# EAGLE schematic NMOS_DESIGN (EAGLE 8.4.1)

## Sheet 1 of 2
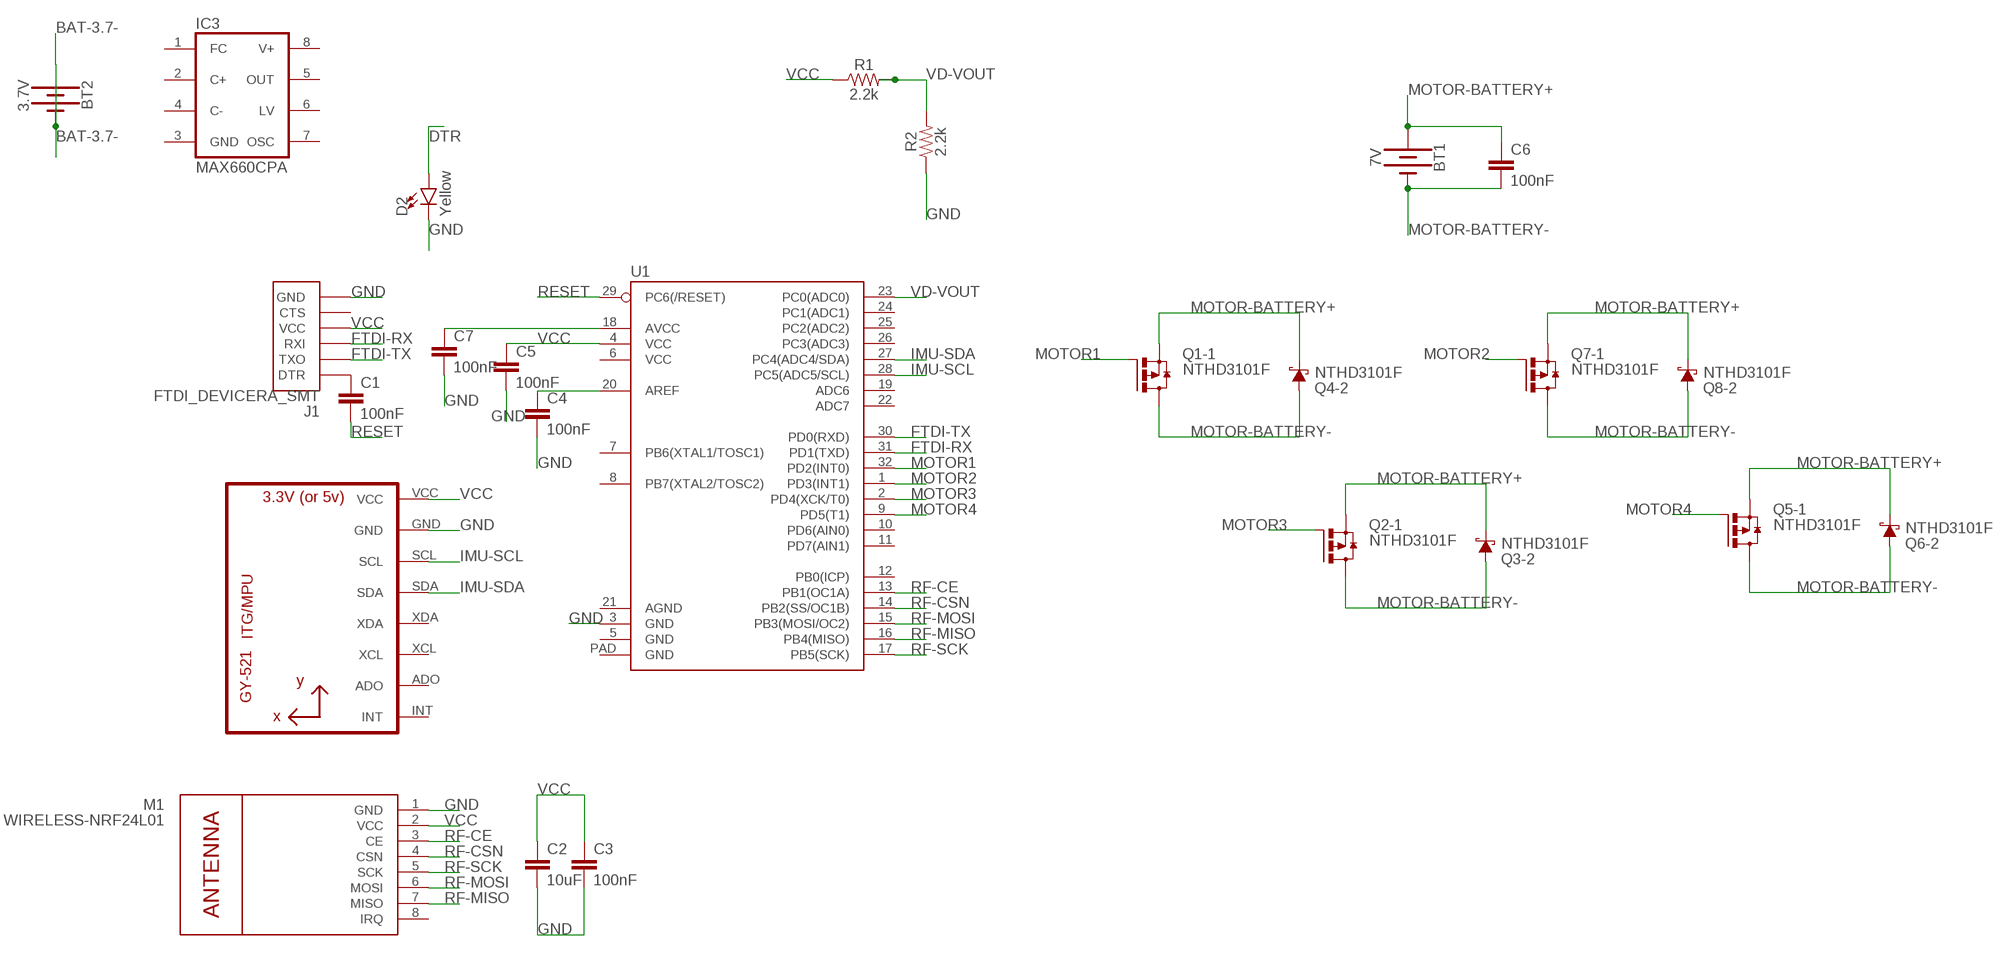
[diagram p0: schematic, sheet 1]

### Parts
BT1  7V  BATTERY-9V  [BATTCON_9V]
BT2  3.7V  BATTERY-9V  [BATTCON_9V]
C1  100nF  0.1UF-25V(+80/-20%)(0603)  [0603-CAP]
C2  10uF  CAP0603-CAP  [0603-CAP]
C3  100nF  CAP0603-CAP  [0603-CAP]
C4  100nF  CAP0603-CAP  [0603-CAP]
C5  100nF  CAP0603-CAP  [0603-CAP]
C6  100nF  CAP0603-CAP  [0603-CAP]
C7  100nF  CAP0603-CAP  [0603-CAP]
D2  Yellow  LED-YELLOW0603  [LED-0603]
IC3  MAX660CPA  [DIL08]
J1  FTDI_DEVICERA_SMT  [FTDI_DEVICE_RA_SMT]
M1  WIRELESS-NRF24L01  [WIRELESS-NRF24L01]
Q1  NTHD3101F  [CHIPFET-1206A]
Q2  NTHD3101F  [CHIPFET-1206A]
Q3  NTHD3101F  [CHIPFET-1206A]
Q4  NTHD3101F  [CHIPFET-1206A]
Q5  NTHD3101F  [CHIPFET-1206A]
Q6  NTHD3101F  [CHIPFET-1206A]
Q7  NTHD3101F  [CHIPFET-1206A]
Q8  NTHD3101F  [CHIPFET-1206A]
R1  2.2k  2.2KOHM-0603-1/10W-1%  [0603]
R2  2.2k  2.2KOHM-0603-1/10W-1%  [0603]
U1  ATMEGA328P_MLFMLF32  [MLF32-PAD]
U2  GY-521MPU6050  [GY-521]

### Nets
BAT-3.7-: BT2.+ BT2.-
DTR: D2.A
FTDI-RX: J1.3(RXI) U1.31(PD1(TXD))
FTDI-TX: J1.2(TXO) U1.30(PD0(RXD))
GND: C2.2 C3.2 C4.2 C5.2 C7.2 D2.C J1.6(GND) M1.1(GND) R2.1 U1.3(GND) U2.GND
IMU-SCL: U1.28(PC5(ADC5/SCL)) U2.SCL
IMU-SDA: U1.27(PC4(ADC4/SDA)) U2.SDA
MOTOR1: Q1.4(-1:G) U1.32(PD2(INT0))
MOTOR2: Q7.4(-1:G) U1.1(PD3(INT1))
MOTOR3: Q2.4(-1:G) U1.2(PD4(XCK/T0))
MOTOR4: Q5.4(-1:G) U1.9(PD5(T1))
MOTOR-BATTERY+: BT1.+ C6.1 Q1.3(-1:S) Q2.3(-1:S) Q3.7(-2:C) Q3.8(-2:C) Q4.7(-2:C) Q4.8(-2:C) Q5.3(-1:S) Q6.7(-2:C) Q6.8(-2:C) Q7.3(-1:S) Q8.7(-2:C) Q8.8(-2:C)
MOTOR-BATTERY-: BT1.- C6.2 Q1.5(-1:D) Q1.6(-1:D) Q2.5(-1:D) Q2.6(-1:D) Q3.1(-2:A) Q3.2(-2:A) Q4.1(-2:A) Q4.2(-2:A) Q5.5(-1:D) Q5.6(-1:D) Q6.1(-2:A) Q6.2(-2:A) Q7.5(-1:D) Q7.6(-1:D) Q8.1(-2:A) Q8.2(-2:A)
N$1: C7.1 U1.18(AVCC)
N$2: C4.1 U1.20(AREF)
N$13: C1.1 J1.1(DTR)
RESET: C1.2 U1.29(PC6(/RESET))
RF-CE: M1.3(CE) U1.13(PB1(OC1A))
RF-CSN: M1.4(CSN) U1.14(PB2(SS/OC1B))
RF-MISO: M1.7(MISO) U1.16(PB4(MISO))
RF-MOSI: M1.6(MOSI) U1.15(PB3(MOSI/OC2))
RF-SCK: M1.5(SCK) U1.17(PB5(SCK))
VCC: C2.1 C3.1 C5.1 J1.4(VCC) M1.2(VCC) R1.1 U1.4(VCC) U2.VCC
VD-VOUT: R1.2 R2.2 U1.23(PC0(ADC0))
Unconnected: IC3.1(FC) IC3.2(C+) IC3.4(C-) IC3.5(OUT) IC3.6(LV) IC3.7(OSC) J1.5(CTS) M1.8(IRQ) Q1.1(-2:A) Q1.2(-2:A) Q1.7(-2:C) Q1.8(-2:C) Q2.1(-2:A) Q2.2(-2:A) Q2.7(-2:C) Q2.8(-2:C) Q3.3(-1:S) Q3.4(-1:G) Q3.5(-1:D) Q3.6(-1:D) Q4.3(-1:S) Q4.4(-1:G) Q4.5(-1:D) Q4.6(-1:D) Q5.1(-2:A) Q5.2(-2:A) Q5.7(-2:C) Q5.8(-2:C) Q6.3(-1:S) Q6.4(-1:G) Q6.5(-1:D) Q6.6(-1:D) Q7.1(-2:A) Q7.2(-2:A) Q7.7(-2:C) Q7.8(-2:C) Q8.3(-1:S) Q8.4(-1:G) Q8.5(-1:D) Q8.6(-1:D) U1.5(GND) U1.6(VCC) U1.7(PB6(XTAL1/TOSC1)) U1.8(PB7(XTAL2/TOSC2)) U1.10(PD6(AIN0)) U1.11(PD7(AIN1)) U1.12(PB0(ICP)) U1.19(ADC6) U1.21(AGND) U1.22(ADC7) U1.24(PC1(ADC1)) U1.25(PC2(ADC2)) U1.26(PC3(ADC3)) U1.PAD(GND) U2.ADO U2.INT U2.XCL U2.XDA

## Sheet 2 of 2

## Power pins joined to a net without a drawn wire
GND: IC3.3(GND)
V+: IC3.8(V+)

## Library data of the parts
BT1 BT2 = SparkFun-Batteries:BATTERY: Battery - Single Cell A variety of battery chemistries, sizes, and footprints. Device List: 20MM_PTH - Coin Cell Battery Holder - 20mm (PTH) <https://www.sparkfun.com/products/783> 12MM_SMD - Coin Cell Battery Holder - 12mm (SMD) <https://www.sparkfun.com/products/10592> 12MM_PTH - Coin Cell Battery Holder - 12mm (PTH) <https://www.sparkfun.com/products/7948> 20MM_SMD - 20mm Coin Cell Battery Holder (SMD) (2 legs) Used on the Big Time Watch Kit <https://www.sparkfun.com/products/11734> 20MM_SMD_4LEGS - Coin Cell Battery Holder - 20mm (SMD) <https://www.sparkfun.com/products/11892> 20MM_SMD_4LEGS_OVERPASTE - Coin Cell Battery Holder - 20mm (SMD) <https://www.sparkfun.com/products/11892> (Over-paste on the legs) 24.5MM_PTH - Coin Cell Battery Holder - 24.5mm (PTH) <https://www.sparkfun.com/products/8863> 9V - 9V Battery Holder - PC Mount Used on the SparkFun SparkPunk Sound Kit <https://www.sparkfun.com/products/11177> and SparkFun SparkPunk Sequencer Kit <https://www.sparkfun.com/products/12707> 18650 - Battery Holder - 18650 (PTH) <https://www.sparkfun.com/products/13113> AA - Battery Holder - 1xAA (PTH) <https://www.sparkfun.com/products/7949> AAA - Battery Holder - 1xAAA (PTH) <https://www.sparkfun.com/products/12718> AA_KIT - Battery Holder - 1xAA (PTH) <https://www.sparkfun.com/products/7949> Special kit package - pads only have exposed copper on one side of the board. AAA_KIT - Battery Holder - 1xAAA (PTH) <https://www.sparkfun.com/products/12718> Special kit package - pads only have exposed copper on one side of the board.; PROD_ID: BATT-10855
C1 = SparkFun-Capacitors:0.1UF-25V(+80/-20%)(0603): CAP-00810 Ceramic Standard decoupling cap; PROD_ID: CAP-00810; VALUE: 0.1uF
C2-C7 = SparkFun-Passives:CAP: Capacitor Standard 0603 ceramic capacitor, and 0.1" leaded capacitor.
D2 = SparkFun-LED:LED-YELLOW: Yellow SMD LED Used in manufacturing several products at SparkFun. Packages: 0603 - SMD 0603 package[Product Link] <http://www.kingbrightusa.com/product.asp?catalog_name=LED&product_id=APT1608SYCK> 0603 -SMART - SMART SMD 0603 package (more efficient/more expensive) [Product Link] <http://www.osram-os.com/osram_os/en/products/product-catalog/led-light-emitting-diodes/smartled-0603/ly-l29k/index.jsp> LilyPad - SMD1206 package[Product Datasheet] <https://www.sparkfun.com/datasheets/DevTools/LilyPad/Q150YUS4.pdf> SparkFun Products: Blynk Board <https://www.sparkfun.com/products/13794> IOIO-OTG <https://www.sparkfun.com/products/13613> XBee Explorer Serial <https://www.sparkfun.com/products/13225>; PROD_ID: DIO-09003
IC3 = maxim:MAX660CPA: Charge-pump VOLTAGE CONVERTER; MF: MAXIM; MPN: MAX660CPA; OC_FARNELL: 1187928; OC_NEWARK: 34C3964
J1 = quad:FTDI_DEVICE: Connector which mates to FTDI basic or FTDI cable.; PROD_ID: CONN-08971
M1 = quad:WIRELESS-NRF24L01: 2.4 GHz Wireless Module based on NRF24L01 chip
Q1-Q8 = transistor-power:NTHD3101F: Power MOSFET and Schottky Diode -20 V, FETKY (TM), P-Channel, 4.4 A, with 4.1 A Schottky Barrier Diode, ChipFET (TM) Source: http://www.onsemi.com/pub/Collateral/NTHD3101F-D.PDF
R1 R2 = SparkFun-Resistors:2.2KOHM: 2.2kΩ resistor A resistor is a passive two-terminal electrical component that implements electrical resistance as a circuit element. Resistors act to reduce current flow, and, at the same time, act to lower voltage levels within circuits. - Wikipedia; PROD_ID: RES-08272
U1 = SparkFun-DigitalIC:ATMEGA328P_MLF: 32-Pin Atmega328 part Commonly used on Arduino compatible boards Available in QFP and QFN packages TQFP is IC-09069 QFN is non-stock
U2 = quad:GY-521